# Altium schematic sheet Main Controller Unit.SchDoc: Main Controller Unit
size A4; Date: Dec. 27th, 2022; Author: Karl Asseily; DrawnBy: Karl Asseily; DocumentNumber: 202301111111; Revision: 1.2; SheetNumber: 10; SheetTotal: 20
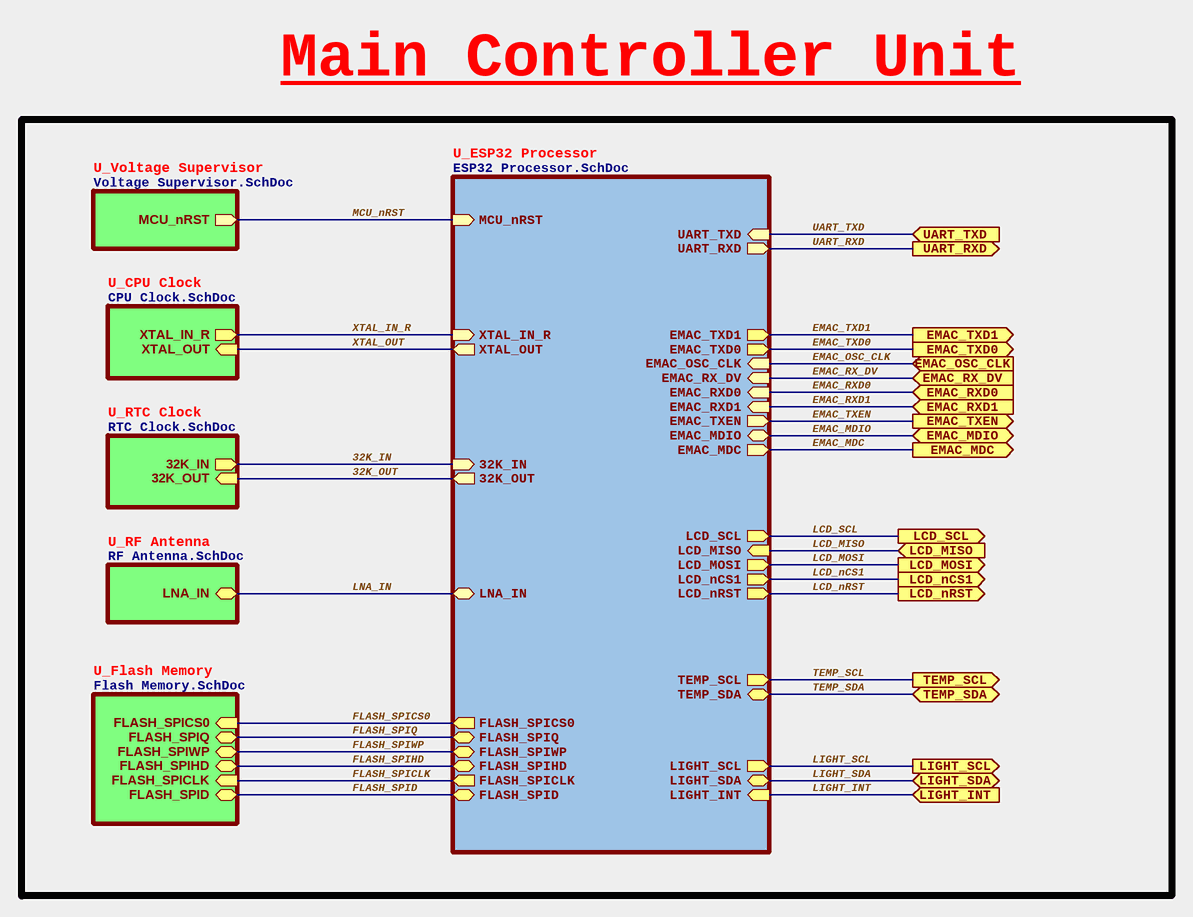
[diagram p0: Main Controller Unit.SchDoc]

## Sub-sheets
U_CPU Clock = CPU Clock.SchDoc: XTAL_IN_R (out), XTAL_OUT (in)
U_ESP32 Processor = ESP32 Processor.SchDoc: LIGHT_INT (in), LIGHT_SCL (out), LIGHT_SDA (bidir), TEMP_SDA (bidir), TEMP_SCL (out), LCD_SCL (out), LCD_MOSI (out), LCD_MISO (in), LCD_nRST (out), LCD_nCS1 (out), EMAC_TXD0 (out), EMAC_TXD1 (out), FLASH_SPICS0 (out), FLASH_SPIQ (bidir), FLASH_SPIWP (bidir), FLASH_SPIHD (bidir), FLASH_SPICLK (out), FLASH_SPID (bidir), LNA_IN (bidir), XTAL_IN_R (in), XTAL_OUT (out), 32K_IN (in), 32K_OUT (out), MCU_nRST (in), UART_TXD (in), UART_RXD (out), EMAC_OSC_CLK (in), EMAC_RX_DV (in), EMAC_RXD0 (in), EMAC_RXD1 (in), EMAC_TXEN (out), EMAC_MDIO (bidir), EMAC_MDC (out)
U_Flash Memory = Flash Memory.SchDoc: FLASH_SPICS0 (in), FLASH_SPIQ (bidir), FLASH_SPIWP (bidir), FLASH_SPIHD (bidir), FLASH_SPICLK (in), FLASH_SPID (bidir)
U_RF Antenna = RF Antenna.SchDoc: LNA_IN (bidir)
U_RTC Clock = RTC Clock.SchDoc: 32K_IN (out), 32K_OUT (in)
U_Voltage Supervisor = Voltage Supervisor.SchDoc: MCU_nRST (out)

## Ports
EMAC_MDC (out, see Cellar Watchdog, ESP32 Processor, Ethernet Controller), EMAC_MDIO (bidir, see Cellar Watchdog, ESP32 Processor, Ethernet Controller), EMAC_OSC_CLK (in, see Cellar Watchdog, ESP32 Processor, Ethernet Controller), EMAC_RX_DV (in, see Cellar Watchdog, ESP32 Processor, Ethernet Controller), EMAC_RXD0 (in, see Cellar Watchdog, ESP32 Processor, Ethernet Controller), EMAC_RXD1 (in, see Cellar Watchdog, ESP32 Processor, Ethernet Controller), EMAC_TXD0 (out, see Cellar Watchdog, ESP32 Processor, Ethernet Controller), EMAC_TXD1 (out, see Cellar Watchdog, ESP32 Processor, Ethernet Controller), EMAC_TXEN (out, see Cellar Watchdog, ESP32 Processor, Ethernet Controller), LCD_MISO (in, see Cellar Watchdog, ESP32 Processor, LCD Display), LCD_MOSI (out, see Cellar Watchdog, ESP32 Processor, LCD Display), LCD_nCS1 (out, see Cellar Watchdog, ESP32 Processor, LCD Display), LCD_nRST (out, see Cellar Watchdog, ESP32 Processor, LCD Display), LCD_SCL (out, see Cellar Watchdog, ESP32 Processor, LCD Display), LIGHT_INT (in, see Cellar Watchdog, ESP32 Processor, Light and Proximity Sensor), LIGHT_SCL (out, see Cellar Watchdog, ESP32 Processor, Light and Proximity Sensor), LIGHT_SDA (bidir, see Cellar Watchdog, ESP32 Processor, Light and Proximity Sensor), TEMP_SCL (out, see Cellar Watchdog, ESP32 Processor, Temp and Humidity Sensor), TEMP_SDA (bidir, see Cellar Watchdog, ESP32 Processor, Temp and Humidity Sensor), UART_RXD (out, see Cellar Watchdog, ESP32 Processor, USB-to-Serial Converter), UART_TXD (in, see Cellar Watchdog, ESP32 Processor, USB-to-Serial Converter)

## Nets
32K_IN: sheet U_ESP32 Processor/32K_IN, sheet U_RTC Clock/32K_IN
32K_OUT: sheet U_ESP32 Processor/32K_OUT, sheet U_RTC Clock/32K_OUT
EMAC_MDC: port EMAC_MDC, sheet U_ESP32 Processor/EMAC_MDC
EMAC_MDIO: port EMAC_MDIO, sheet U_ESP32 Processor/EMAC_MDIO
EMAC_OSC_CLK: port EMAC_OSC_CLK, sheet U_ESP32 Processor/EMAC_OSC_CLK
EMAC_RX_DV: port EMAC_RX_DV, sheet U_ESP32 Processor/EMAC_RX_DV
EMAC_RXD0: port EMAC_RXD0, sheet U_ESP32 Processor/EMAC_RXD0
EMAC_RXD1: port EMAC_RXD1, sheet U_ESP32 Processor/EMAC_RXD1
EMAC_TXD0: port EMAC_TXD0, sheet U_ESP32 Processor/EMAC_TXD0
EMAC_TXD1: port EMAC_TXD1, sheet U_ESP32 Processor/EMAC_TXD1
EMAC_TXEN: port EMAC_TXEN, sheet U_ESP32 Processor/EMAC_TXEN
FLASH_SPICLK: sheet U_Flash Memory/FLASH_SPICLK, sheet U_ESP32 Processor/FLASH_SPICLK
FLASH_SPICS0: sheet U_Flash Memory/FLASH_SPICS0, sheet U_ESP32 Processor/FLASH_SPICS0
FLASH_SPID: sheet U_Flash Memory/FLASH_SPID, sheet U_ESP32 Processor/FLASH_SPID
FLASH_SPIHD: sheet U_Flash Memory/FLASH_SPIHD, sheet U_ESP32 Processor/FLASH_SPIHD
FLASH_SPIQ: sheet U_Flash Memory/FLASH_SPIQ, sheet U_ESP32 Processor/FLASH_SPIQ
FLASH_SPIWP: sheet U_Flash Memory/FLASH_SPIWP, sheet U_ESP32 Processor/FLASH_SPIWP
LCD_MISO: port LCD_MISO, sheet U_ESP32 Processor/LCD_MISO
LCD_MOSI: port LCD_MOSI, sheet U_ESP32 Processor/LCD_MOSI
LCD_nCS1: port LCD_nCS1, sheet U_ESP32 Processor/LCD_nCS1
LCD_nRST: port LCD_nRST, sheet U_ESP32 Processor/LCD_nRST
LCD_SCL: port LCD_SCL, sheet U_ESP32 Processor/LCD_SCL
LIGHT_INT: port LIGHT_INT, sheet U_ESP32 Processor/LIGHT_INT
LIGHT_SCL: port LIGHT_SCL, sheet U_ESP32 Processor/LIGHT_SCL
LIGHT_SDA: port LIGHT_SDA, sheet U_ESP32 Processor/LIGHT_SDA
LNA_IN: sheet U_RF Antenna/LNA_IN, sheet U_ESP32 Processor/LNA_IN
MCU_nRST: sheet U_ESP32 Processor/MCU_nRST, sheet U_Voltage Supervisor/MCU_nRST
TEMP_SCL: port TEMP_SCL, sheet U_ESP32 Processor/TEMP_SCL
TEMP_SDA: port TEMP_SDA, sheet U_ESP32 Processor/TEMP_SDA
UART_RXD: port UART_RXD, sheet U_ESP32 Processor/UART_RXD
UART_TXD: port UART_TXD, sheet U_ESP32 Processor/UART_TXD
XTAL_IN_R: sheet U_ESP32 Processor/XTAL_IN_R, sheet U_CPU Clock/XTAL_IN_R
XTAL_OUT: sheet U_ESP32 Processor/XTAL_OUT, sheet U_CPU Clock/XTAL_OUT

## Notes on the sheet
- Main Controller Unit
- Project
- Sheet
- Size
- Filename
- A4
- of
- Number
- Drawn By
- Rev.
- Variant
- Date